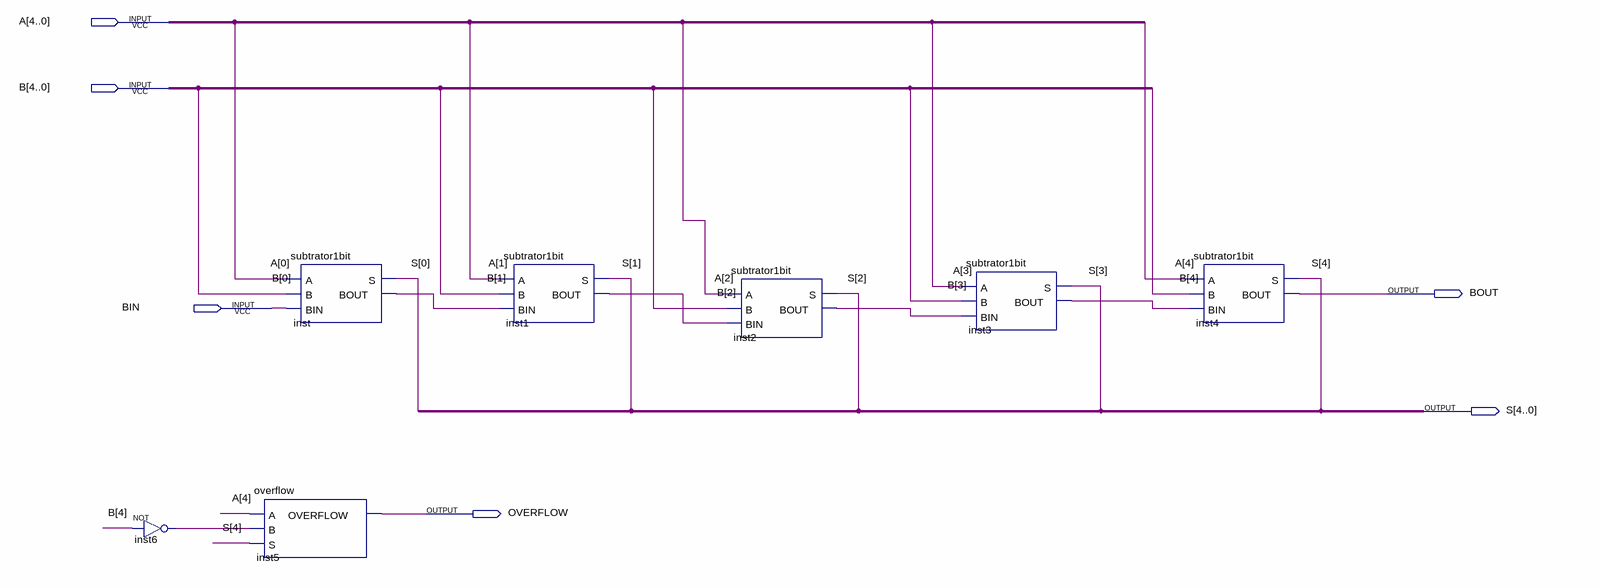
[diagram p0: schematic sheet]
// Quartus schematic subtrator5bit.bdf as structural Verilog: 7 symbols, 6 pins
module subtrator5bit (
  input  [4:0] A,
  input  [4:0] B,
  input  BIN,
  output BOUT,
  output [4:0] S,
  output OVERFLOW
);

  wire inst1_bout, inst2_bout, inst3_bout, inst6_out, inst_bout;

  not inst6 (inst6_out, B[4]);
  overflow inst5 (.A(A[4]), .B(inst6_out), .S(S[4]), .OVERFLOW(OVERFLOW));
  subtrator1bit inst (.A(A[0]), .B(B[0]), .BIN(BIN), .S(S[0]), .BOUT(inst_bout));
  subtrator1bit inst1 (.A(A[1]), .B(B[1]), .BIN(inst_bout), .S(S[1]), .BOUT(inst1_bout));
  subtrator1bit inst2 (.A(A[2]), .B(B[2]), .BIN(inst1_bout), .S(S[2]), .BOUT(inst2_bout));
  subtrator1bit inst3 (.A(A[3]), .B(B[3]), .BIN(inst2_bout), .S(S[3]), .BOUT(inst3_bout));
  subtrator1bit inst4 (.A(A[4]), .B(B[4]), .BIN(inst3_bout), .S(S[4]), .BOUT(BOUT));
endmodule
